# EAGLE design Zio Qwiic Power adapter (EAGLE 9.3.1)
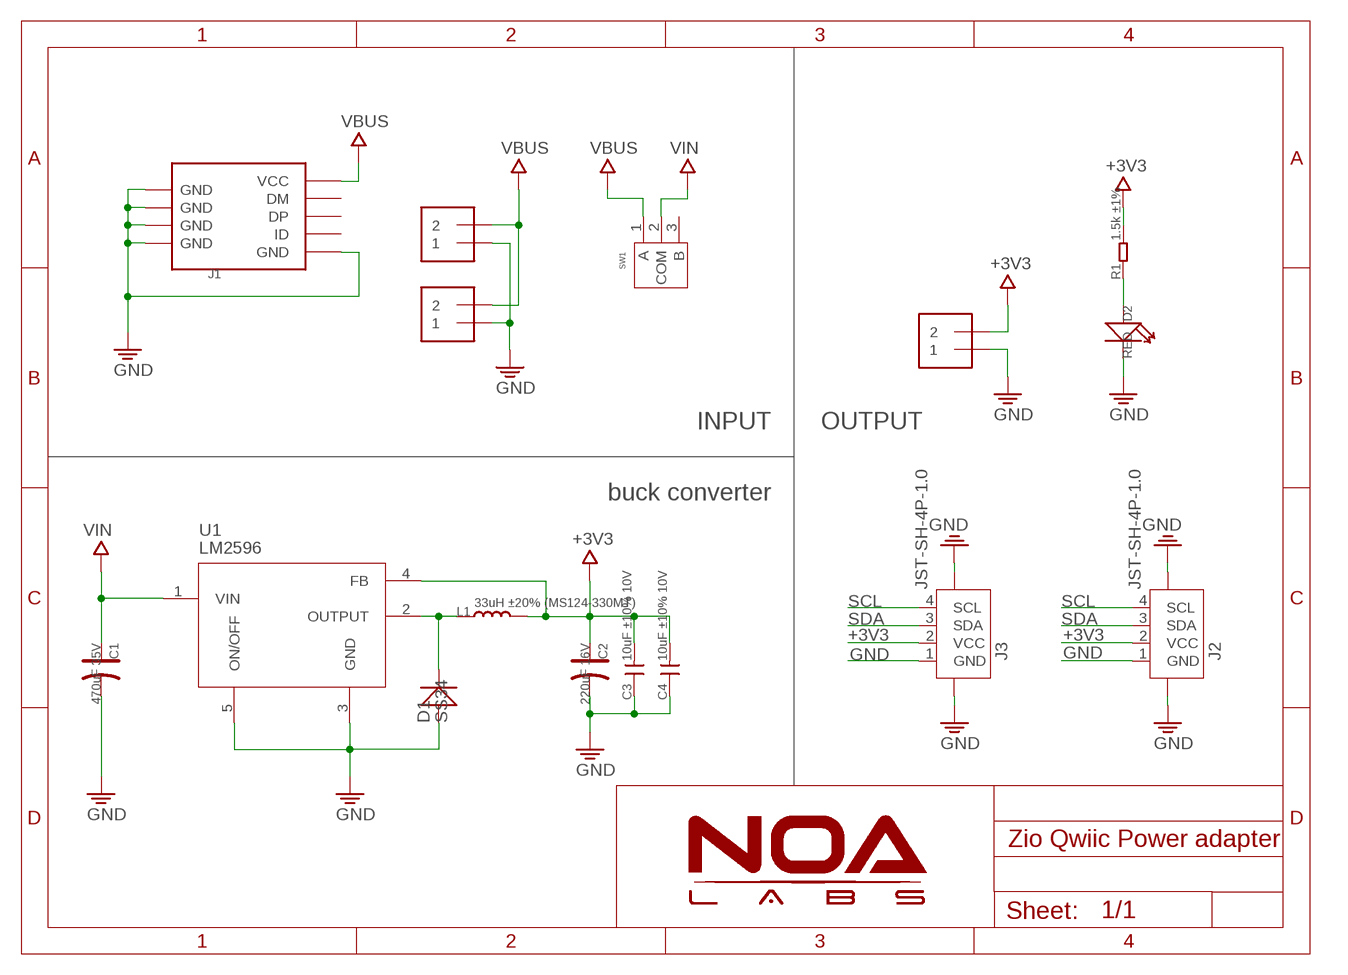
[diagram p0: schematic, sheet 1]

## Parts
C1  470uF 35V  CAP-ELECTRO-G  [ELECTRO-SMD-G-10MM]
C2  220uF 16V  CAP-ELECTRO-C  [ELECTRO-SMD-C-6MM]
C3  10uF ±10% 10V  C-1206  [C1206]
C4  10uF ±10% 10V  C-1206  [C1206]
D1  SS34  D-B130L-13-F  [SMA]
D2  RED  LED'0603'  [LED-0603]
J1  USB-MICROE  [MICRO-SMD]
J2  JST-SH-4P-1.0  [JST-SH-4P]
J3  JST-SH-4P-1.0  [JST-SH-4P]
J4  TERMBLOCK_1X2-3.5MM  [1X2-3.5MM]
J5  TERMBLOCK_1X2-3.5MM  [1X2-3.5MM]
J6  TERMBLOCK_1X2-3.5MM  [1X2-3.5MM]
L1  33uH ±20% (MS124-330MT)  L12.2*12.2  [L-12.2*12.2]
R1  1.5k ±1%  R-0603  [R0603]
SW1  SWITCH-2H-3P2A/3A  [3P-2CH-12.7X6.6X6.35H]
U1  LM2596  [TO-263]

## Nets
+3V3: C2.+ C3.2 C4.2 J2.2(VCC) J3.2(VCC) J5.2 L1.2 R1.2 U1.4(FB)
GND: C1.- C2.- C3.1 C4.1 D1.P$2(+) D2.- J1.GND J1.S1(GND) J1.S1@1(GND) J1.S1@2(GND) J1.S2(GND) J1.S2@1(GND) J1.S2@2(GND) J1.S3(GND) J1.S3@1(GND) J1.S3@2(GND) J1.S4(GND) J1.S4@1(GND) J1.S4@2(GND) J1.S5(GND) J1.S6(GND) J2.1(GND) J2.NC1 J2.NC2 J3.1(GND) J3.NC1 J3.NC2 J4.1 J5.1 J6.1 U1.3(GND) U1.5(ON/OFF)
N$1: D2.+ R1.1
OUTPUT: D1.P$1(-) L1.1 U1.2(OUTPUT)
SCL: J2.4(SCL) J3.4(SCL)
SDA: J2.3(SDA) J3.3(SDA)
VBUS: J1.VBUS(VCC) J4.2 J6.2 SW1.1(A)
VIN: C1.+ SW1.2(COM) U1.1(VIN)
Unconnected: J1.D+(DP) J1.D-(DM) J1.ID SW1.3(B)

## Notes on the sheet
- INPUT | OUTPUT
- buck converter

## Library data of the parts
C1 = Discretex:CAP*: Electrolytic Capacitors,Tantalum Capacitors and Super Capacitors
C2 = Discrete:CAP*: Electrolytic Capacitors,Tantalum Capacitors and Super Capacitors
C3 C4 = RCL:C
D1 = Discretex:D*
D2 = Discrete_NOA:LED*
J1 = Connector_NOA:USB-MICROE
J2 J3 = Connector:JST-SH-4P
J4-J6 = microbuilder:TERMBLOCK_1X2: 3.5mm Terminal block http://www.ladyada.net/library/pcb/eaglelibrary.html
L1 = Discretex:L*
R1 = RCL:R
SW1 = Discretex:SWITCH-2H-3P
U1 = IC:LM2596

## Board
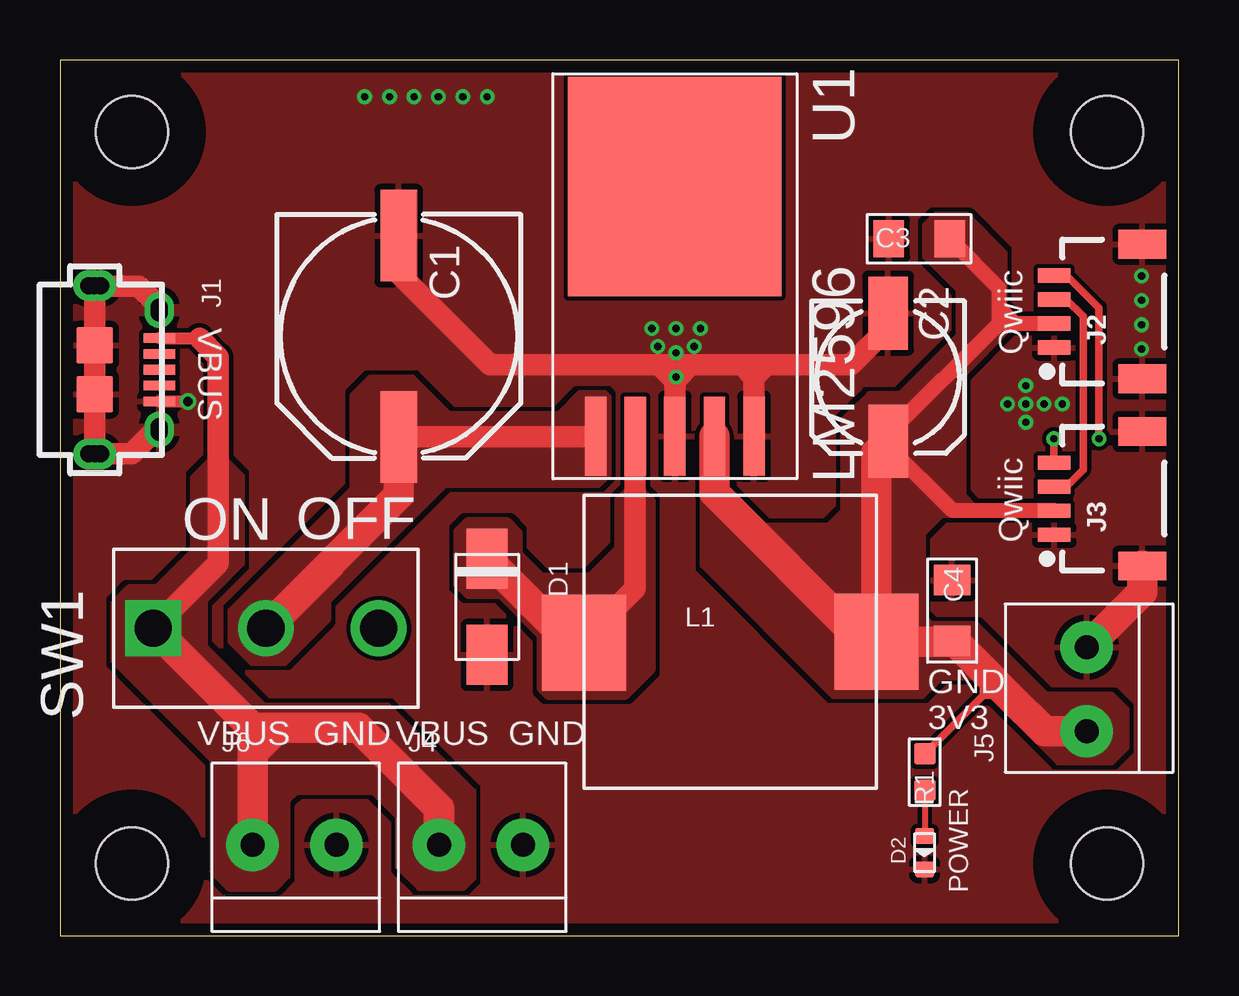
[diagram p1: board, top side]
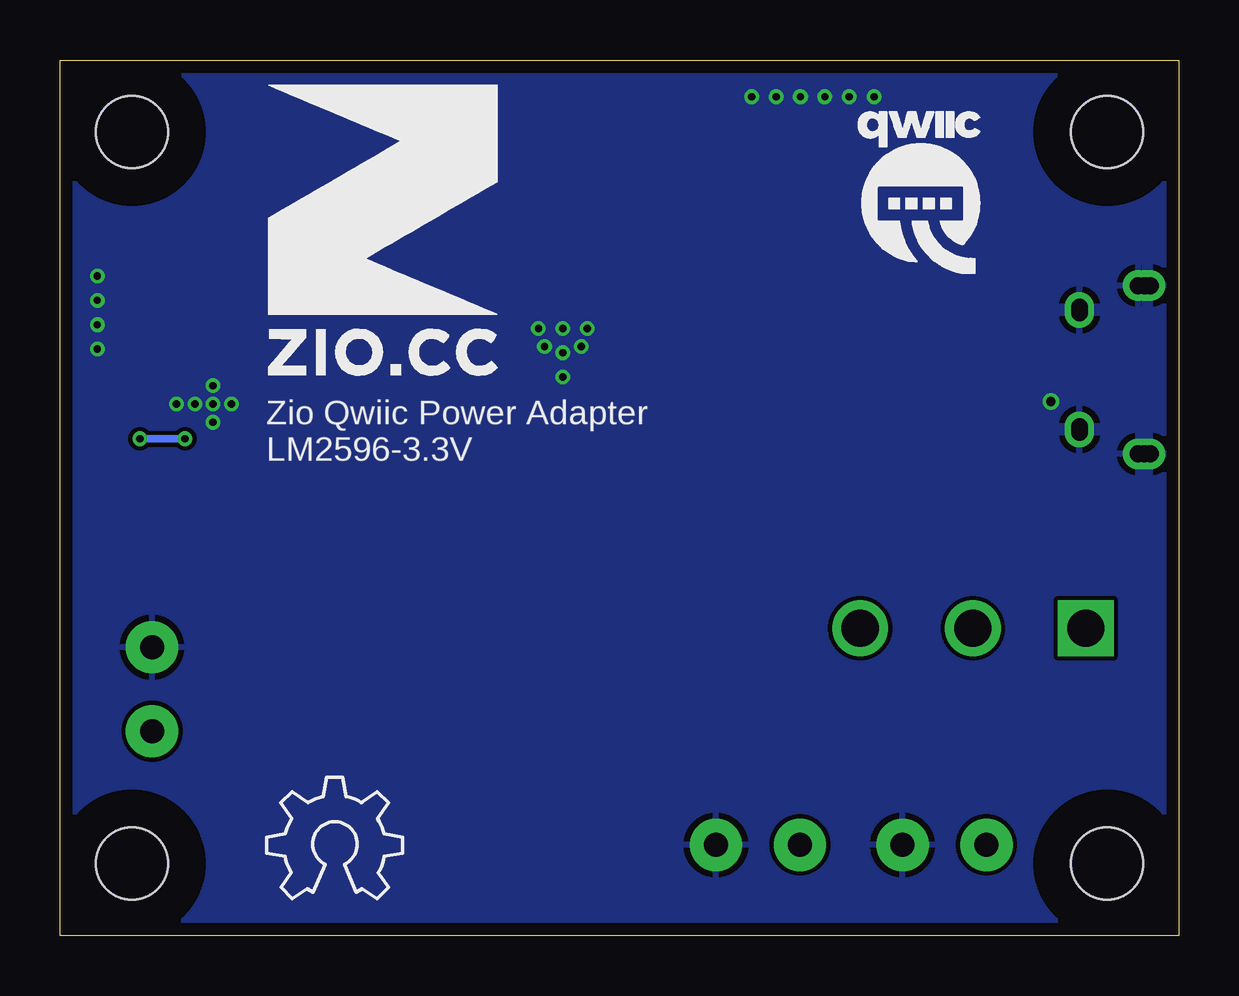
[diagram p2: board, bottom side, seen from below]

Size 46.64 x 36.48 mm. Coordinates in mm from the lower left corner, seen from the top.
Outline: 0,0 46.64,0 46.64,36.48 0,36.48 0,0
Copper layers (1*16): Top 0.035mm / dielectric 1.5mm / Bottom 0.035mm
Design rules "NOA Eagle Rule": minimum track width 7mil, minimum drill 12mil, track to track 7mil, track to pad 7mil, pad to pad 7mil, via to via 7mil, smd to smd 0mil, copper to edge 20mil, drill to drill 10mil, minimum pad ring 10mil, minimum via ring 6mil, stop-mask expansion 2mil, vias tented up to drill 25mil, thermal gap 10mil
Holes 3 mm at 3,3 3,33.48 43.64,33.48 43.64,3
tRestrict: area 0,0 to 6,6; area 40.6,0 to 46.6,6; area 40.6,30.5 to 46.6,36.5; area 0,30.5 to 6,36.5
bRestrict: area 0,30.5 to 6,36.5; area 40.6,30.5 to 46.6,36.5; area 40.6,0 to 46.6,6; area 0,0 to 6,6

### Footprints (pad centres in the part's own frame; a part is rotated, then mirrored left to right if it is on the bottom)
ELECTRO-SMD-G-10MM = smd 3.81 x 1.524: + 4.191,0; - -4.191,0
ELECTRO-SMD-C-6MM = smd 3.048 x 1.651: + 2.667,0; - -2.667,0
C1206 = smd 1.27 x 1.524: 1 -1.27,0; 2 1.27,0
SMA = smd 2.5 x 1.7: P$1 -2,0; P$2 2,0
LED-0603 = smd 0.635 x 0.8: + 0.699,0; - -0.699,0
MICRO-SMD = smd 0.406 x 1.346: D+ 0,2.057; D- -0.66,2.057; GND 1.321,2.057; ID 0.66,2.057; VBUS -1.321,2.057 | drill 0.7: S1 -2.489,2.057; S1@1 -2.616,2.057; S1@2 -2.362,2.057; S2 2.464,2.057; S2@1 2.362,2.057; S2@2 2.616,2.057 | drill 0.7 pad 1.27: S3 -3.505,-0.66; S3@1 -3.505,-0.381; S3@2 -3.505,-0.889; S4 3.505,-0.635; S4@1 3.505,-0.381; S4@2 3.505,-0.889 | smd 1.524 x 1.524: S5 -1.016,-0.635; S6 1.016,-0.635
JST-SH-4P = smd 0.6 x 1.35: 1 1.5,0; 2 0.5,0; 3 -0.5,0; 4 -1.5,0 | smd 1.2 x 2: NC1 -2.8,3.675; NC2 2.8,3.675
1X2-3.5MM = drill 1 pad 2.184: 1 1.8,0; 2 -1.7,0
L-12.2*12.2 = smd 3.5 x 4: 1 -6.1,-0.05; 2 6.1,0
R0603 = smd 0.889 x 0.889: 1 -0.762,0; 2 0.762,0
3P-2CH-12.7X6.6X6.35H = drill 1.55 square: 1 0,4.7 | drill 1.55: 2 0,0; 3 0,-4.7
TO-263 = smd 3.302 x 0.889: 1 3.302,-3.302; 2 3.302,-1.651; 3 3.302,0; 4 3.302,1.651; 5 3.302,3.302 | smd 9.144 x 8.89: TAB -7.112,0

### Placement (x,y rotation side)
C1  14.12,24.97 270 top
C2  34.52,23.27 270 top
C3  35.81,29.03 0 top
C4  37.19,13.54 270 top
D1  17.81,13.69 270 top
D2  36.04,3.45 90 top
J1  2.08,23.57 270 top
J2  41.44,26 270 top
J3  41.44,18.2 270 top
J4  17.5,3.77 0 top
J5  42.8,10.21 90 top
J6  9.72,3.77 0 top
L1  27.94,12.24 0 top
R1  36.04,6.81 90 top
SW1  8.59,12.8 90 top
U1  25.63,24.1 270 top
U$6  [12MM]  38.05,23.27 0 bottom
U$7  [QWIIC-LOGO-MEDIUM]  10.82,31.01 0 bottom
U$8  [OSHW_6X200_NOTEXT]  38.02,1.52 0 bottom

### Tracks (layer width: path | path; a pad name or v marks a point on that pad's centre or on a via)
+3V3
  Top 0.305: R1.2 38.49,10.02 | 38.49,10.02 39.53,10.02 | 38.49,10.02 38.49,10.99 38.53,11.02
  Top 0.635: 34.52,21.67 C2.+ | J3.2 37.21,17.7 34.52,20.39 34.52,20.88 39.14,25.5 | J2.2 39.8,25.5 | 39.8,25.5 39.14,25.5 | C3.2 39.14,26.98 39.14,26.16 | 39.14,26.16 39.14,25.5 | 39.8,25.5 39.14,26.16 | C4.2 34.06,12.27 L1.2
  Top 1.27: J5.2 41.05,8.51 39.53,10.02 38.53,11.02 37.31,12.24 L1.2 | 34.52,20.39 C2.+ 34.04,20.12 L1.2 | U1.4 27.28,18.44 33.48,12.24 L1.2
  pour Top (no thermals): 26.77,18.62 26.77,15.44 32.08,10.13 32.23,9.98 35.97,9.98 36.75,10.77 38.05,10.77 41.61,7.21 43.38,7.21 43.84,7.21 44.48,7.85 44.48,9.4 44.12,9.75 43.84,10.03 42.09,10.03 41.12,10.03 38.18,12.98 36.32,12.98 35.99,13.31 35.99,15.88 35.99,16.76 36.63,17.4 36.75,17.53 37.95,17.53 38.1,17.68 38.1,17.88 37.67,18.31 37.67,23.39 39.6,25.32 39.6,25.96 39.4,26.16 39.4,28.42 37.8,30.02 36.47,30.02 36.45,30 36.04,29.59 36.04,28.42 36.04,28.3 37.44,26.9 37.44,24.99 35,22.56 33.73,22.56 33.32,22.15 32.64,21.46 32.64,17.68 32.03,17.07 29.36,17.07 27.81,18.62
GND  (via drill 0.3, 0.38)
  Top 0.508: J1.GND v5.33,22.25
  Top 0.889: U1.3 25.63,23.11 | 25.63,23.11 26.29,23.77 | 26.29,23.77 28.42,23.77 | 28.93,23.27 U1.5 | 28.42,23.77 28.93,23.27 | J1.S4@2 1.45,20.32 J1.S6 J1.S5 1.45,27.05 | 1.45,27.05 J1.S3 | J1.S1@1 3.28,27.05 1.45,27.05 | J1.S2@1 3,20.07 J1.S4 | 26.29,23.77 24.97,23.77 | 24.97,23.77 17.93,23.77 14.12,27.58 C1.- | 25.63,23.11 24.97,23.77 | 28.42,23.77 29.44,23.77 | 28.93,23.27 29.44,23.77 | 34.52,26.8 C2.- 34.52,25.32 32.97,23.77 29.44,23.77
  Top 1.27: J5.1 45.12,14.33 J3.NC2
  other vias: 41.78,22.15 41.02,22.15 40.26,22.15 39.5,22.15 40.26,22.91 40.26,21.39 12.7,34.95 13.74,34.95 14.76,34.95 15.77,34.95 16.79,34.95 17.81,34.95 45.09,27.48 45.09,26.47 45.09,25.45 45.09,24.43 25.68,23.27 25.68,24.28 25.68,25.3 26.7,25.3 24.66,25.3 24.92,24.54 26.44,24.54
  pour Top (rank 2): 0,36.47 46.63,36.47 46.63,0 0,0
  pour Bottom: 0,36.47 46.63,36.47 46.63,0 0,0
N$1
  Top 0.254: R1.1 D2.+
OUTPUT
  Top 0.889: L1.1 21.87,12.22 21.87,12.34 23.98,14.45 U1.2
  Top 1.27: D1.P$1 21.3,12.19 L1.1
  pour Top (no thermals): 23.65,18.57 23.22,18.14 23.22,16.13 22.07,14.99 20.17,14.99 20.09,14.99 19.18,15.9 19.18,16.79 18.67,17.3 16.97,17.3 16.64,16.97 16.51,16.84 16.51,14.66 16.51,14.63 16.99,14.15 18.34,14.15 19.99,12.5 19.99,10.29 20.27,10.01 20.32,9.96 23.6,9.96 24.71,11.07 24.71,17.88 24.71,18.14 24.33,18.52 24.28,18.57
SCL  (via drill 0.3)
  Top 0.305: J2.4 41.97,27.5 43.31,26.16 v43.31,20.7 | v41.43,20.7 41.43,19.71 J3.4
  Bottom 0.305: v43.31,20.7 v41.43,20.7
SDA
  Top 0.305: J2.3 41.95,26.5 42.65,25.81 42.65,19.41 41.94,18.7 J3.3
VBUS
  Top 0.508: J1.VBUS 5.81,24.89
  Top 0.889: 5.81,24.89 6.6,24.11 6.6,15.52 SW1.1
  Top 1.27: J6.2 8.02,7.24 8.02,7.62 | 8.02,7.62 8.02,8.66 | 8.02,8.66 SW1.1 | J4.2 15.8,5.31 12.44,8.66 9.07,8.66 | 9.07,8.66 8.02,8.66 | 9.07,8.66 8.02,7.62
  pour Top (no thermals): 6.3,19.84 5.54,19.08 5.54,16 4.04,14.5 2.87,14.5 2.21,13.84 2.21,11.46 6.35,7.32 6.35,2.67 7.06,1.96 8.97,1.96 9.5,2.49 9.5,5.61 9.88,5.99 13.06,5.99 14.1,4.95 14.1,2.84 14.96,1.98 16.81,1.98 17.25,2.41 17.25,5.99 13.67,9.58 8.51,9.58 6.05,12.04 6.05,13.97 7.59,15.52 7.59,19.13 6.88,19.84
VIN
  Top 0.889: U1.1 22.3,20.78 C1.+
  Top 1.27: SW1.2 14.12,18.34 C1.+
  pour Top (no thermals): 7.11,12.24 7.11,13.54 12.19,18.62 12.19,22.5 12.95,23.27 14.68,23.27 16.21,21.74 20.8,21.74 21.67,22.61 22.71,22.61 22.86,22.45 22.86,19.2 22.43,18.77 16.03,18.77 11.18,13.92 11.18,13.16 9.37,11.35 8,11.35

### Text on the board
tPlace: VBUS | Qwiic | OFF | ON | Qwiic | GND | 3V3 | VBUS | GND | VBUS | GND | POWER
bPlace: Zio Qwiic Power Adapter / LM2596-3.3V